# Altium project Brduino.PrjPcb
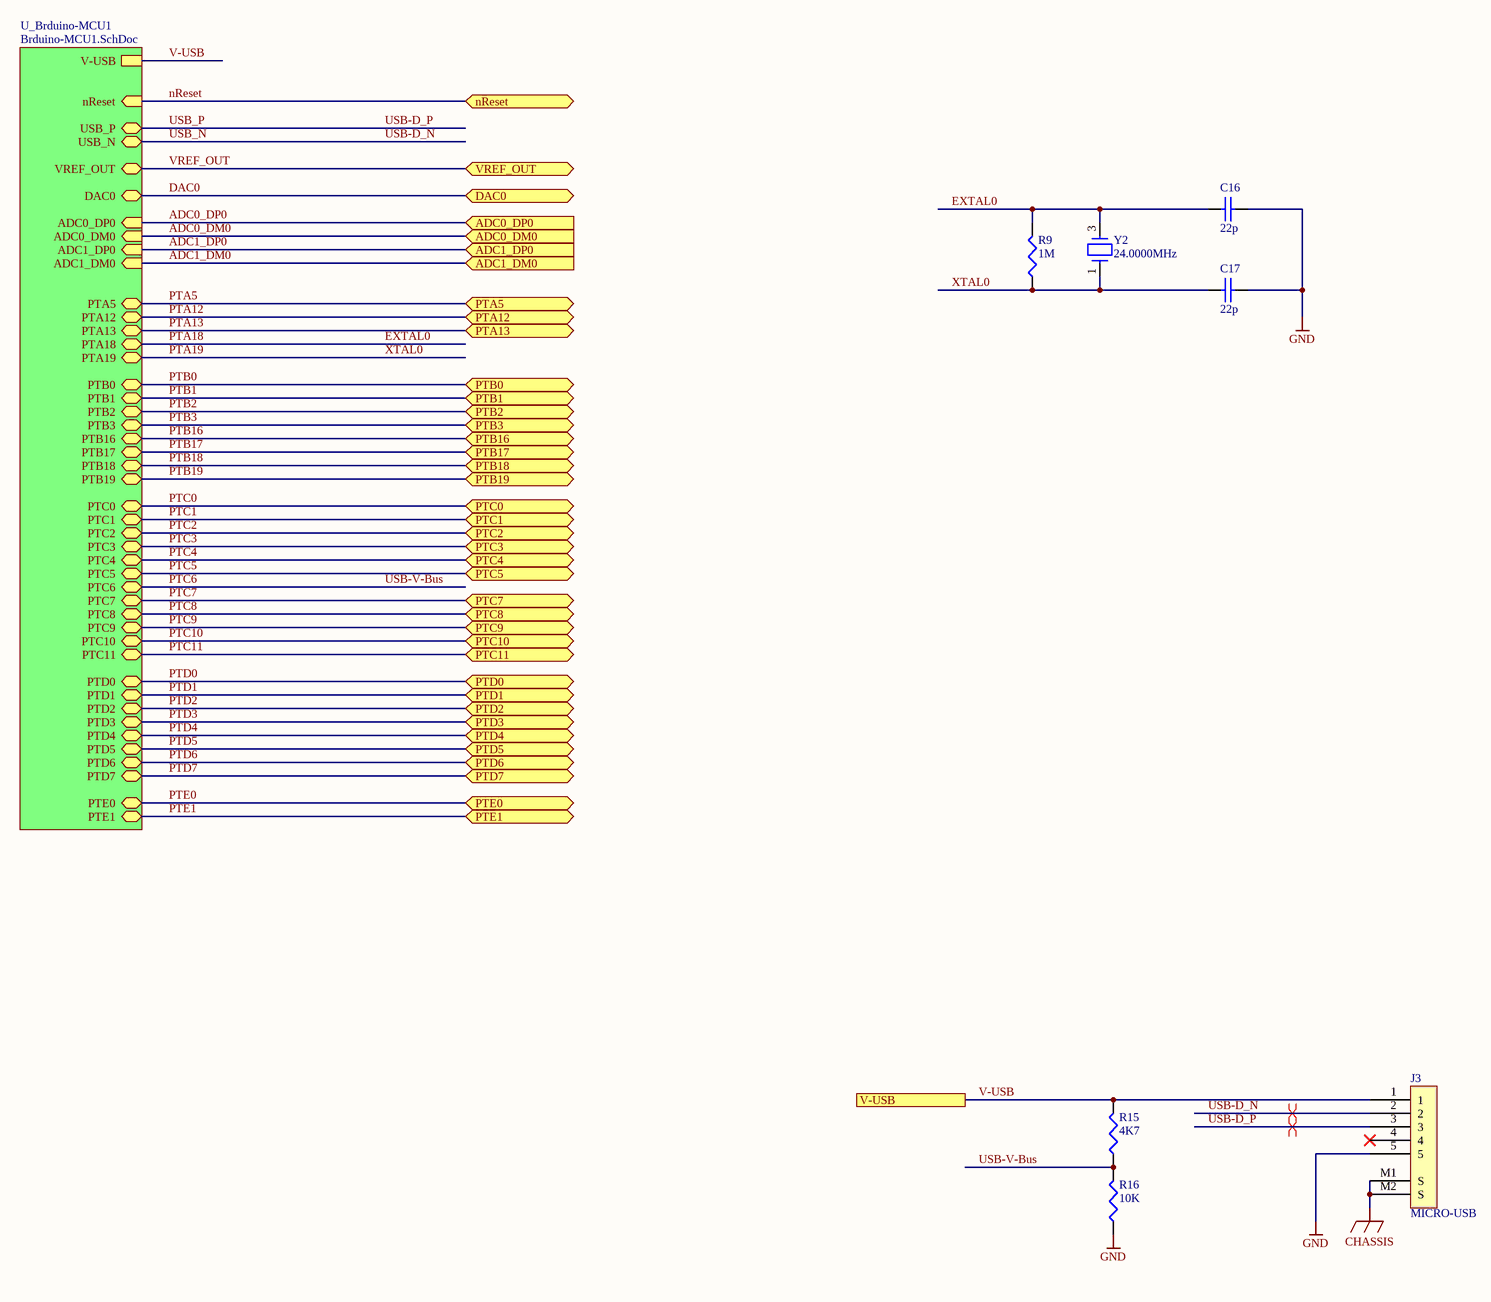
[diagram p0: Brduino-MCU-Main.SchDoc]
2 sheets, 18 parts. Net scope: hierarchical (ports join the sheet entries above them; power ports are global).
Board file: Brduino.PcbDoc
Sheets:
  Brduino-MCU-Main.SchDoc
  Brduino-PwrLin.SchDoc

## Sheet Brduino-MCU-Main.SchDoc: BRDUINO
size A3; Organization: TDK Micronas; DocumentNumber: tbd; Revision: 0.00.001; SheetNumber: 2; SheetTotal: 4; Date: 8/14/2020; DrawnBy: Moerz; Engineer: Moerz

### Parts
C16  22p  [C0402]
C17  22p  [C0402]
J3  MICRO-USB  [Molex-0565790519]  (no BOM)
R9  1M  [R0402]
R15  4K7  [R0402]
R16  10K  [R0402]
Y2  24.0000MHz  [EPSON-XTAL6 3.2mm x 5mm 4pin]

### Sub-sheets
U_Brduino-MCU1 = Brduino-MCU1.SchDoc (file not in this document): nReset (in), V-USB, PTE0 (bidir), PTE1 (bidir), PTA5 (bidir), PTA12 (bidir), PTA13 (bidir), PTA18 (bidir), PTA19 (bidir), PTB0 (bidir), PTB1 (bidir), PTB2 (bidir), PTB3 (bidir), PTB16 (bidir), PTB17 (bidir), PTB18 (bidir), PTB19 (bidir), PTC0 (bidir), PTC1 (bidir), PTC2 (bidir), PTC3 (bidir), PTC4 (bidir), PTC5 (bidir), PTC6 (bidir), PTC7 (bidir), PTC8 (bidir), PTC9 (bidir), PTC10 (bidir), PTC11 (bidir), PTD0 (bidir), PTD1 (bidir), PTD2 (bidir), PTD3 (bidir), PTD4 (bidir), PTD5 (bidir), PTD6 (bidir), PTD7 (bidir), ADC0_DP0 (in), ADC0_DM0 (in), ADC1_DP0 (in), ADC1_DM0 (in), VREF_OUT (bidir), DAC0 (bidir), USB_P (bidir), USB_N (bidir)

### Ports
ADC0_DM0 (in), ADC0_DP0 (in), ADC1_DM0 (in), ADC1_DP0 (in), DAC0 (bidir), nReset (bidir), PTA5 (bidir), PTA12 (bidir), PTA13 (bidir), PTB0 (bidir), PTB1 (bidir), PTB2 (bidir), PTB3 (bidir), PTB16 (bidir), PTB17 (bidir), PTB18 (bidir), PTB19 (bidir), PTC0 (bidir), PTC1 (bidir), PTC2 (bidir), PTC3 (bidir), PTC4 (bidir), PTC5 (bidir), PTC7 (bidir), PTC8 (bidir), PTC9 (bidir), PTC10 (bidir), PTC11 (bidir), PTD0 (bidir), PTD1 (bidir), PTD2 (bidir), PTD3 (bidir), PTD4 (bidir), PTD5 (bidir), PTD6 (bidir), PTD7 (bidir), PTE0 (bidir), PTE1 (bidir), V-USB, VREF_OUT (bidir)

### Nets
CHASSIS: J3.M1(S) J3.M2(S)
GND: C16.2 C17.2 J3.5 R16.1
ADC0_DM0: port ADC0_DM0, sheet U_Brduino-MCU1/ADC0_DM0
ADC0_DP0: port ADC0_DP0, sheet U_Brduino-MCU1/ADC0_DP0
ADC1_DM0: port ADC1_DM0, sheet U_Brduino-MCU1/ADC1_DM0
ADC1_DP0: port ADC1_DP0, sheet U_Brduino-MCU1/ADC1_DP0
DAC0: port DAC0, sheet U_Brduino-MCU1/DAC0
EXTAL0: C16.1 R9.2 Y2.3 ; sheet U_Brduino-MCU1/PTA18  [also labelled PTA18]
nReset: port nReset, sheet U_Brduino-MCU1/nReset
PTA5: port PTA5, sheet U_Brduino-MCU1/PTA5
PTA12: port PTA12, sheet U_Brduino-MCU1/PTA12
PTA13: port PTA13, sheet U_Brduino-MCU1/PTA13
PTA19: C17.1 R9.1 Y2.1 ; sheet U_Brduino-MCU1/PTA19  [also labelled XTAL0]
PTB0: port PTB0, sheet U_Brduino-MCU1/PTB0
PTB1: port PTB1, sheet U_Brduino-MCU1/PTB1
PTB2: port PTB2, sheet U_Brduino-MCU1/PTB2
PTB3: port PTB3, sheet U_Brduino-MCU1/PTB3
PTB16: port PTB16, sheet U_Brduino-MCU1/PTB16
PTB17: port PTB17, sheet U_Brduino-MCU1/PTB17
PTB18: port PTB18, sheet U_Brduino-MCU1/PTB18
PTB19: port PTB19, sheet U_Brduino-MCU1/PTB19
PTC0: port PTC0, sheet U_Brduino-MCU1/PTC0
PTC1: port PTC1, sheet U_Brduino-MCU1/PTC1
PTC2: port PTC2, sheet U_Brduino-MCU1/PTC2
PTC3: port PTC3, sheet U_Brduino-MCU1/PTC3
PTC4: port PTC4, sheet U_Brduino-MCU1/PTC4
PTC5: port PTC5, sheet U_Brduino-MCU1/PTC5
PTC6: R15.1 R16.2 ; sheet U_Brduino-MCU1/PTC6  [also labelled USB-V-Bus]
PTC7: port PTC7, sheet U_Brduino-MCU1/PTC7
PTC8: port PTC8, sheet U_Brduino-MCU1/PTC8
PTC9: port PTC9, sheet U_Brduino-MCU1/PTC9
PTC10: port PTC10, sheet U_Brduino-MCU1/PTC10
PTC11: port PTC11, sheet U_Brduino-MCU1/PTC11
PTD0: port PTD0, sheet U_Brduino-MCU1/PTD0
PTD1: port PTD1, sheet U_Brduino-MCU1/PTD1
PTD2: port PTD2, sheet U_Brduino-MCU1/PTD2
PTD3: port PTD3, sheet U_Brduino-MCU1/PTD3
PTD4: port PTD4, sheet U_Brduino-MCU1/PTD4
PTD5: port PTD5, sheet U_Brduino-MCU1/PTD5
PTD6: port PTD6, sheet U_Brduino-MCU1/PTD6
PTD7: port PTD7, sheet U_Brduino-MCU1/PTD7
PTE0: port PTE0, sheet U_Brduino-MCU1/PTE0
PTE1: port PTE1, sheet U_Brduino-MCU1/PTE1
USB-D_N: J3.2 ; sheet U_Brduino-MCU1/USB_N  [also labelled USB_N]
USB-D_P: J3.3 ; sheet U_Brduino-MCU1/USB_P  [also labelled USB_P]
V-USB: J3.1 R15.2 ; port V-USB, sheet U_Brduino-MCU1/V-USB
VREF_OUT: port VREF_OUT, sheet U_Brduino-MCU1/VREF_OUT

Not connected (* = marked no-connect by the designer): J3 4*

### Layout directives
differential pair: USB-D_N, USB-D_P

### Notes on the sheet
- Title
- Size:
- Date:
- A3
- Number:
- Time:
- Revision:
- Sheet
- of
- R
- Schlossstrasse 50
- D-66352 Karlsbrunn
- Germany
- Engineering GmbH
- ev
- ision
- O
- ne
- File:

### Library data of the parts
C16 C17 = CAP: POPULATED: yes; Parameters: C0G, 16V, 5%
J3 = MICRO-USB: MFR-PN: USB3080; MFR: GCT; POPULATED: yes
R9 R15 R16 = RES1A: POPULATED: yes; Parameters: 1/16W, 50V, 1%
Y2 = CRYSTAL-5X3.2: MFR: EPSON; MFR-PN: FA-238 24.0000MB-C; Parameters: -20°C/+70°C, 50ppm, 18pF, 60ohms; POPULATED: yes

## Sheet Brduino-PwrLin.SchDoc: BRDUINO
size A3; Organization: TDK Micronas; DocumentNumber: tbd; Revision: 0.00.001; SheetNumber: 4; SheetTotal: 4; Date: 8/14/2020; DrawnBy: Moerz; Engineer: Moerz
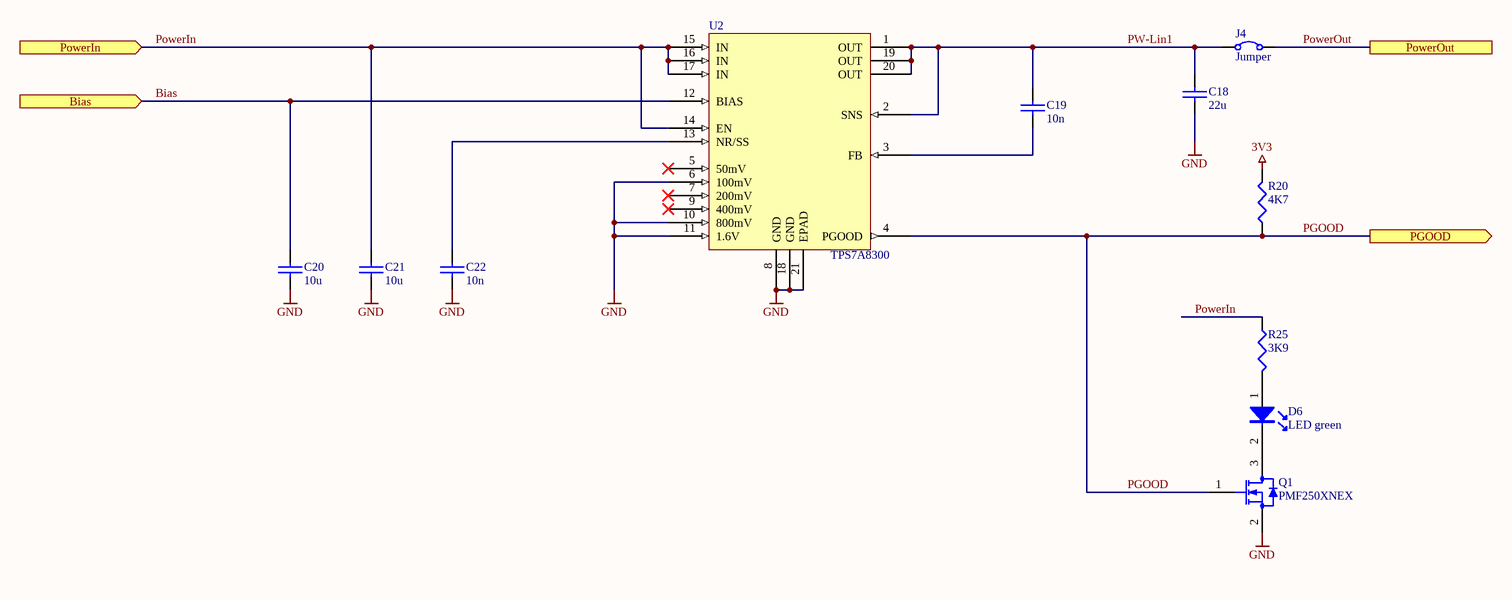
[diagram p1: Brduino-PwrLin.SchDoc]

### Parts
C18  22u  [C0805]
C19  10n  [C0402]
C20  10u  [C0805]
C21  10u  [C0805]
C22  10n  [C0402]
D6  LED green  [LED0603]
J4  Jumper  [JumperSMD]  (no BOM)
Q1  PMF250XNEX  [SOT323]
R20  4K7  [R0402]
R25  3K9  [R0402]
U2  TPS7A8300  [S-PVQFN-N20]

### Ports
Bias (in), PGOOD (out), PowerIn (in), PowerOut

### Nets
3V3: R20.2
GND: C18.1 C20.1 C21.1 C22.2 Q1.2(S) U2.6(100mV) U2.8(GND) U2.10(800mV) U2.11(1.6V) U2.18(GND) U2.21(EPAD)
Bias: C20.2 U2.12(BIAS) ; port Bias
PGOOD: Q1.1(G) R20.1 U2.4(PGOOD) ; port PGOOD
PowerIn: C21.2 R25.1 U2.14(EN) U2.15(IN) U2.16(IN) U2.17(IN) ; port PowerIn
PowerOut: J4.2 ; port PowerOut
PW-Lin1: C18.2 C19.1 J4.1 U2.1(OUT) U2.2(SNS) U2.19(OUT) U2.20(OUT)  [project net PW-Lin1_4]
NetC19_2: C19.2 U2.3(FB)
NetC22_1: C22.1 U2.13(NR/SS)
NetD6_1: D6.1(A) R25.2
NetD6_2: D6.2(K) Q1.3(D)

Not connected (* = marked no-connect by the designer): U2 5(50mV)* 7(200mV)* 9(400mV)*

### Notes on the sheet
- Title
- Size:
- Date:
- A3
- Number:
- Time:
- Revision:
- Sheet
- of
- R
- Schlossstrasse 50
- D-66352 Karlsbrunn
- Germany
- Engineering GmbH
- ev
- ision
- O
- ne
- File:

### Library data of the parts
C18 = CAP: MFR-PN: GRM21BR61A226ME44#; MFR: MURATA; Parameters: X5R, 10V, 10%; POPULATED: yes
C19 C22 = CAP: MFR-PN: GRM155R71H103KA88#; MFR: MURATA; POPULATED: yes; Parameters: X7R, 50V, 10%
C20 C21 = CAP: MFR-PN: GRM21BR61E106KA73#; MFR: MURATA; Parameters: X5R, 25V, 10%; POPULATED: yes
D6 = LED: MFR-PN: APHD1608LCGCK; MFR: KINGBRIGHT; POPULATED: yes; Parameters: If >= 2mA
J4 = Jumper: POPULATED: yes
Q1 = MOSFET-N-D: N-Channel MOSFET; MFR: NEXPERIA; POPULATED: yes; MFR-PN: PMF250XNEX
R20 R25 = RES1A: as R9 on sheet Brduino-MCU-Main
U2 = TPS7A8300: MFR-PN: TPS7A8300RGWT; MFR: TI; POPULATED: yes

## Nets that join several sheets
GND: Brduino-MCU-Main (C16.2 C17.2 J3.5 R16.1), Brduino-PwrLin (11 pins)

## Assembly variants
Main Variant: not fitted R11 R13 R16 R50_2 R52_1 R52_2 R54_1 R54_2 R87 R89 R91